# Altium schematic sheet 4K7 SMD 201.schdoc
size 127 x 99 mm
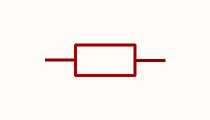
[diagram p0: 4K7 SMD 201.schdoc]

## Parts
U?  4.7kΩ  [R0201]  (value not drawn)

## Nets

Not connected (* = marked no-connect by the designer): U? 1 2

## Library data of the parts
U? = AF0201FR-074K7L: Manufacturer: YAGEO(国巨); Add into BOM: yes; Tolerance: ±1%; Temperature Coefficient: ±200ppm/℃; Symbol: AF0201FR-074K7L; Device: AF0201FR-074K7L; LCSC Part Name: 厚膜电阻 4.7kΩ ±1% 50mW; Supplier Part: C2105831; Manufacturer Part: AF0201FR-074K7L; Supplier Footprint: 0201; JLCPCB Part Class: Extended Part; Datasheet: https://atta.szlcsc.com/upload/public/pdf/source/20210712/C2105831_B7E5D2600BF229B29F1C9CE0CCE2B3D7.pdf; Supplier: LCSC; Convert to PCB: yes; Type: Thick Film Resistors; Value: 4.7kΩ; Operating Temperature Range: -55℃~+125℃